# Altium project Galaxy.PrjPcb
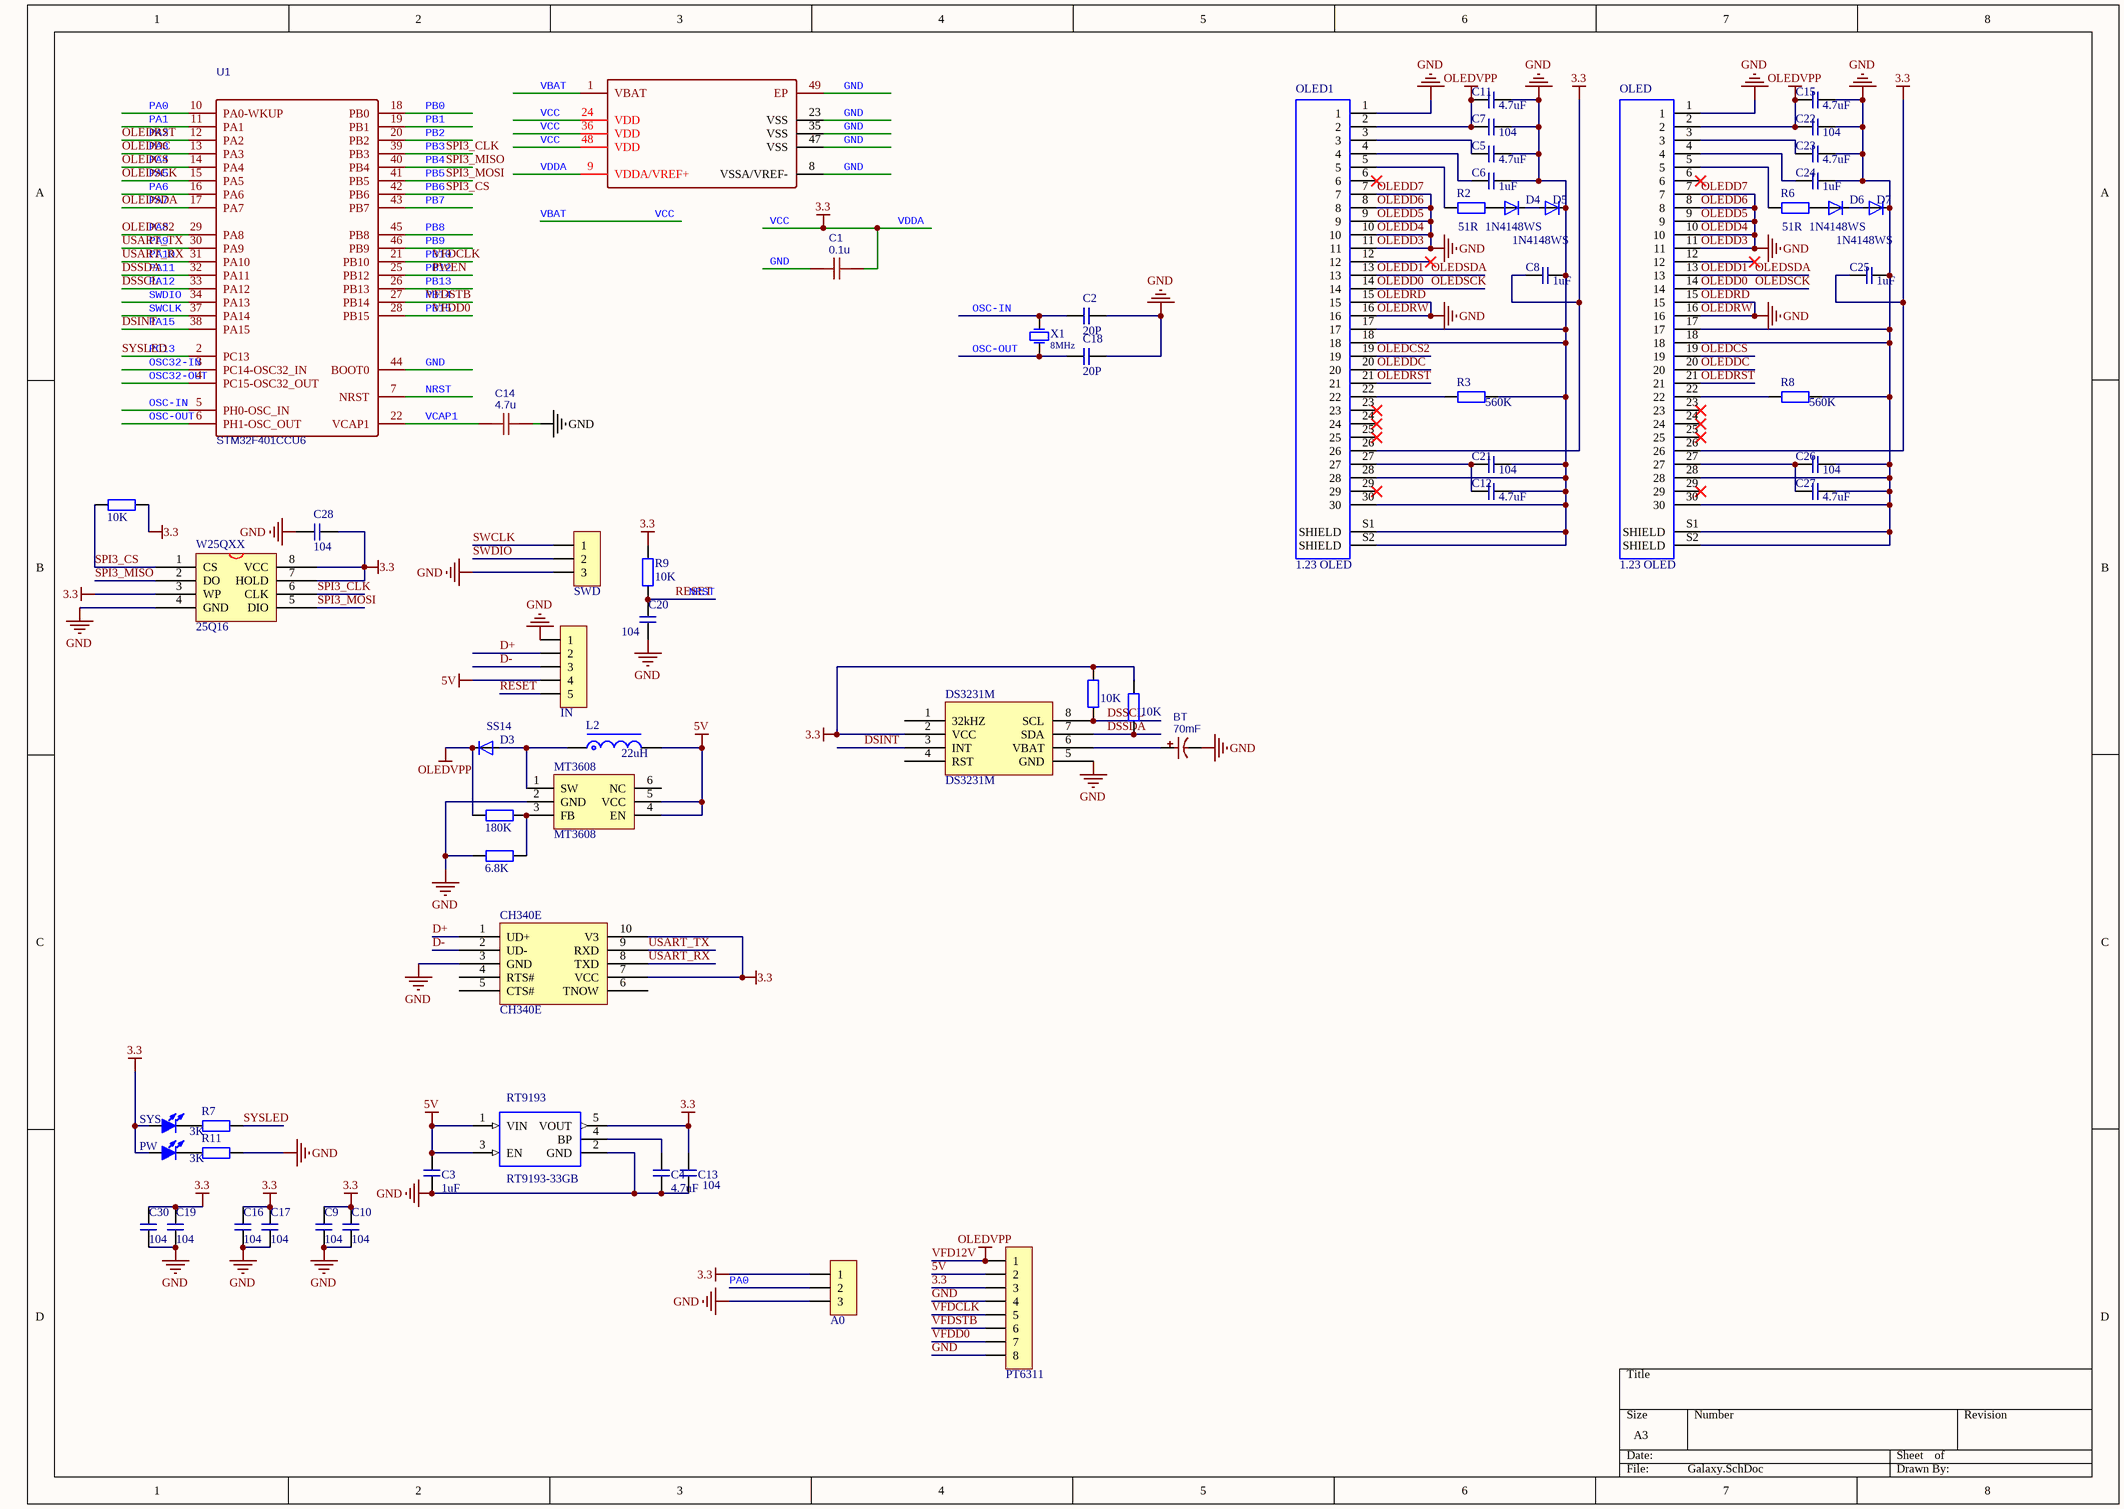
[diagram p0: Galaxy.SchDoc]
1 sheet, 63 parts. Net scope: global (net labels, ports and power ports of the same name join across sheets).
Board file: Galaxy.PcbDoc

## Sheet Galaxy.SchDoc
size A3

### Parts
A0  HDR-1X3  [ZH1.5-WS-3P]  (value not drawn)
BT  70mF  [CAP-TH_BD4.8-P3.95_SM3R3703T01]
C1  0.1u  [0603C]
C2  20P  [0603C]
C3  1uF  [0603C]
C4  4.7uF  [0603C]
C5  4.7uF  [0603C]
C6  1uF  [0603C]
C7  104  [0603C]
C8  1uF  [0603C]
C9  104  [0603C]
C10  104  [0603C]
C11  4.7uF  [0603C]
C12  4.7uF  [0603C]
C13  104  [0603C]
C14  4.7u  [0603C]
C15  4.7uF  [0603C]
C16  104  [0603C]
C17  104  [0603C]
C18  20P  [0603C]
C19  104  [0603C]
C20  104  [0603C]
C21  104  [0603C]
C22  104  [0603C]
C23  4.7uF  [0603C]
C24  1uF  [0603C]
C25  1uF  [0603C]
C26  104  [0603C]
C27  4.7uF  [0603C]
C28  104  [0603C]
C30  104  [0603C]
CH340E  CH340E  [MSOP10_L]
D3  SS14  [SOD323_1N4148WS]
D4  1N4148WS  [SOD323_1N4148WS]
D5  1N4148WS  [SOD323_1N4148WS]
D6  1N4148WS  [SOD323_1N4148WS]
D7  1N4148WS  [SOD323_1N4148WS]
DS3231M  DS3231M  [SOP8]
IN  HDR-1X5  [ZH1.5-WS-5P]  (value not drawn)
L2  22uH  [1210-ec]
MT3608  MT3608  [SOT23-6N]
OLED  1.23 OLED  [1.23 OLED]
OLED1  1.23 OLED  [1.23 OLED]
PT6311  HDR-1X8  [ZH1.5-WS-8P]  (value not drawn)
PW  白色  [0603LED]  (value not drawn)
R2  51R  [0603R]
R3  560K  [0603R]
R4  10K  [0603R]
R5  10K  [0603R]
R6  51R  [0603R]
R7  3K  [0603R]
R8  560K  [0603R]
R9  10K  [0603R]
R10  10K  [0603R]
R11  3K  [0603R]
RB  180K  [0603R]
RS  6.8K  [0603R]
RT9193  RT9193-33GB  [sot23-5]
SWD  HDR-1X3  [ZH1.5-WS-3P]  (value not drawn)
SYS  粉色  [0603LED]  (value not drawn)
U1  STM32F401CCU6  [UFQFPN-48_L7.0-W7.0-P0.50-BL-EP]
W25QXX  25Q16  [SOIC-8]
X1  value 8MHz  [OSC 5032-2P]  (hidden comment: 1.6.1.01.005.001)

### Nets
3.3: A0.1 C1.1 C8.1 C9.1 C10.1 C13.2 C16.1 C17.1 C19.1 C25.1 C28.2 C30.1 CH340E.7(VCC) CH340E.10(V3) DS3231M.2(VCC) OLED.26 OLED1.26 PT6311.3 PW.1(A) R4.1 R5.2 R9.1 R10.1 RT9193.5(VOUT) SYS.1(A) U1.1(VBAT) U1.9(VDDA/VREF+) U1.24(VDD) U1.36(VDD) U1.48(VDD) W25QXX.3(WP) W25QXX.7(HOLD) W25QXX.8(VCC)  [also labelled VBAT, VCC, VDDA]
5V: C3.2 IN.4 L2.2 MT3608.4(EN) MT3608.5(VCC) PT6311.2 RT9193.1(VIN) RT9193.3(EN)
GND: A0.3 BT.2 C1.2 C2.1 C3.1 C4.1 C5.2 C6.2 C7.2 C8.2 C9.2 C10.2 C11.2 C12.2 C13.1 C14.2 C15.2 C16.2 C17.2 C18.1 C19.2 C20.2 C21.2 C22.2 C23.2 C24.2 C25.2 C26.2 C27.2 C28.1 C30.2 CH340E.3(GND) D5.C D7.C DS3231M.5(GND) IN.1 MT3608.2(GND) OLED.1 OLED.7 OLED.8 OLED.9 OLED.10 OLED.11 OLED.15 OLED.16 OLED.17 OLED.18 OLED.28 OLED.30 OLED.S1(SHIELD) OLED.S2(SHIELD) OLED1.1 OLED1.7 OLED1.8 OLED1.9 OLED1.10 OLED1.11 OLED1.15 OLED1.16 OLED1.17 OLED1.18 OLED1.28 OLED1.30 OLED1.S1(SHIELD) OLED1.S2(SHIELD) PT6311.4 PT6311.8 R3.1 R8.1 R11.1 RS.1 RT9193.2(GND) SWD.3 U1.8(VSSA/VREF-) U1.23(VSS) U1.35(VSS) U1.44(BOOT0) U1.47(VSS) U1.49(EP) W25QXX.4(GND)  [also labelled OLEDD3, OLEDD4, OLEDD5, OLEDD6, OLEDD7, OLEDRD, OLEDRW]
VFD12V: C7.1 C11.1 C15.1 C22.1 D3.C OLED.2 OLED1.2 PT6311.1 RB.1  [also labelled OLEDVPP]
D+: CH340E.1(UD+) IN.2
D-: CH340E.2(UD-) IN.3
DSINT: DS3231M.3(INT) U1.38(PA15)  [also labelled PA15]
DSSCL: DS3231M.8(SCL) R10.2 U1.33(PA12)  [also labelled PA12]
DSSDA: DS3231M.7(SDA) R4.2 U1.32(PA11)  [also labelled PA11]
NRST: C20.1 IN.5 R9.2 U1.7(NRST)  [also labelled RESET]
OLEDCS: OLED.19 U1.14(PA4)  [also labelled PA4]
OLEDCS2: OLED1.19 U1.29(PA8)  [also labelled PA8]
OLEDD0: OLED.14 OLED1.14 U1.15(PA5)  [also labelled OLEDSCK, PA5]
OLEDD1: OLED.13 OLED1.13 U1.17(PA7)  [also labelled OLEDSDA, PA7]
OLEDDC: OLED.20 OLED1.20 U1.13(PA3)  [also labelled PA3]
OLEDRST: OLED.21 OLED1.21 U1.12(PA2)  [also labelled PA2]
OSC32-IN: U1.3(PC14-OSC32_IN)
OSC32-OUT: U1.4(PC15-OSC32_OUT)
OSC-IN: C2.2 U1.5(PH0-OSC_IN) X1.1(OSC1)
OSC-OUT: C18.2 U1.6(PH1-OSC_OUT) X1.2(OSC2)
PA0: A0.2 U1.10(PA0-WKUP)
PA1: U1.11(PA1)
PA6: U1.16(PA6)
PA9: CH340E.9(RXD) U1.30(PA9)  [also labelled USART_TX]
PA10: CH340E.8(TXD) U1.31(PA10)  [also labelled USART_RX]
PB0: U1.18(PB0)
PB1: U1.19(PB1)
PB2: U1.20(PB2)
PB3: U1.39(PB3) W25QXX.6(CLK)  [also labelled SPI3_CLK]
PB4: U1.40(PB4) W25QXX.2(DO)  [also labelled SPI3_MISO]
PB5: U1.41(PB5) W25QXX.5(DIO)  [also labelled SPI3_MOSI]
PB6: R5.1 U1.42(PB6) W25QXX.1(CS)  [also labelled SPI3_CS]
PB7: U1.43(PB7)
PB8: U1.45(PB8)
PB9: U1.46(PB9)
PB10: PT6311.5 U1.21(PB10)  [also labelled VFDCLK]
PB12: U1.25(PB12)  [also labelled PWEN]
PB13: U1.26(PB13)
PB14: PT6311.6 U1.27(PB14)  [also labelled VFDSTB]
PB15: PT6311.7 U1.28(PB15)  [also labelled VFDD0]
PC13: R7.1 U1.2(PC13)  [also labelled SYSLED]
SWCLK: SWD.1 U1.37(PA14)
SWDIO: SWD.2 U1.34(PA13)
VCAP1: C14.1 U1.22(VCAP1)
NetBT_1: BT.1 DS3231M.6(VBAT)
NetC4_2: C4.2 RT9193.4(BP)
NetC5_1: C5.1 OLED1.3
NetC6_1: C6.1 OLED1.4
NetC12_1: C12.1 C21.1 OLED1.27
NetC23_1: C23.1 OLED.3
NetC24_1: C24.1 OLED.4
NetC26_1: C26.1 C27.1 OLED.27
NetD3_A: D3.A L2.1 MT3608.1(SW)
NetD4_A: D4.A R2.1
NetD4_C: D4.C D5.A
NetD6_A: D6.A R6.1
NetD6_C: D6.C D7.A
NetMT3608_3: MT3608.3(FB) RB.2 RS.2
NetOLED1_5: OLED1.5 R2.2
NetOLED1_22: OLED1.22 R3.2
NetOLED_5: OLED.5 R6.2
NetOLED_22: OLED.22 R8.2
NetPW_2: PW.2(K) R11.2
NetR7_2: R7.2 SYS.2(K)

Not connected (* = marked no-connect by the designer): CH340E 4(RTS#) 5(CTS#) 6(TNOW); DS3231M 1(32kHZ) 4(RST); MT3608 6(NC); OLED 6* 12* 23* 24* 25* 29*; OLED1 6* 12* 23* 24* 25* 29*

### Library data of the parts
A0 SWD = Header 3: 3P接插件; 版权归属: 源创客; BOM名称: 3P接插件; 学习资源: www.ooocke.com
BT = 70mF: BOM_Manufacturer: KORCHIP; BOM_Manufacturer Part: SM3R3703T01; nameAlias: Capacitance; Contributor: LCSC; BOM_Supplier: LCSC; BOM_Supplier Part: C132600; spicePre: C; spiceSymbolName: SM3R3703T01
C1 = 0.1u: nameAlias: Value(F); Contributor: LCEDA_Lib; spicePre: C; spiceSymbolName: C_0402_US
C2-C13 C15-C28 C30 = 电容
C14 = 4.7u: nameAlias: Value(F); Contributor: LCEDA_Lib; spicePre: C; spiceSymbolName: C_0402_US
D3-D7 = 1N4148WS: Diode Switching 75V 0.3A 2-Pin SOD-323 T/R; MF: ON Semiconductor; SnapEDA_Link: https://www.snapeda.com/parts/1N4148WS/ON%20Semiconductor/view-part/?ref=snap; Price: None; Availability: Unavailable; MP: 1N4148WS; Package: S-0 Good-Ark; Value: *
IN = Header 5: 5P接插件; 版权归属: 源创客; BOM名称: 5P接插件; 学习资源: www.ooocke.com
L2 = L-CDRH: 功率屏蔽电感; 版权归属: 源创客; BOM名称: 功率屏蔽电感; 学习资源: www.ooocke.com
MT3608 = SX1308: 可调升压芯片; 版权归属: 源创客; BOM名称: 可调升压芯片; 学习资源: www.ooocke.com
OLED OLED1 = FH12-30S-0.5SH(55): FH12 Series 30 Position 0.5 mm Pitch Surface Mount Right Angle Flip Lock FFC/FPC; MF: Hirose Electric; MP: FH12-30S-0.5SH_55_; Package: None; Availability: Unavailable; SnapEDA_Link: https://www.snapeda.com/parts/FH12-30S-0.5SH%2855%29/Hirose%20Electric%20Co%20Ltd/view-part/?ref=snap; Price: None; Value: *
PT6311 = Header 8: 8P接插件; 版权归属: 源创客; BOM名称: 8P接插件; 学习资源: www.ooocke.com
PW SYS = LED-F234: 方形LED; 版权归属: 源创客; BOM名称: 方形LED; 学习资源: www.ooocke.com
R2-R11 RB RS = R: 贴片电阻; 版权归属: 源创客; BOM名称: 贴片电阻; 学习资源: www.ooocke.com
RT9193 = RT9193-33GB: RT9193 Series 300 mA 3.3 V Ultra-Low Noise Ultra-Fast CMOS LDO Regulator-SC-70-5; MF: Richtek USA; SnapEDA_Link: https://www.snapeda.com/parts/RT9193-33GB/Richtek%20USA%20Inc./view-part/?ref=snap; Price: None; Availability: Unavailable; Package: SOT-23-5 Richtek; MP: RT9193-33GB; Value: *
U1 = STM32F401CCU6: BOM_Manufacturer: ST; subpart_no: 1; tags: STM32; BOM_Supplier Part: C79861; BOM_Supplier: LCSC; BOM_Manufacturer Part: STM32F401CCU6; spicePre: U; spiceSymbolName: STM32F401CCU6
W25QXX = W25Q16
X1 = 1.6.1.01.005.001: XTAL,8MHz,±20PPM,12.6*4.5; K3 No.: 1.6.1.01.005.001; GENERAL: *